# EAGLE design led-pcb (EAGLE 7.2.0)
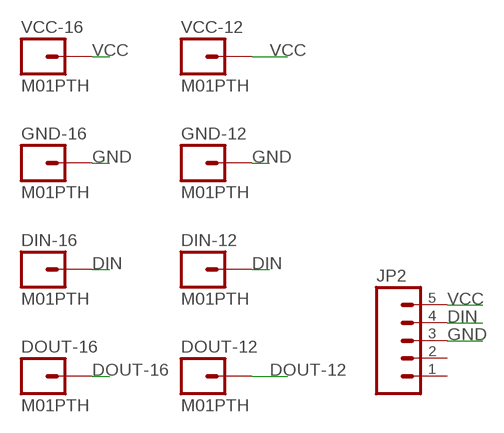
[diagram p0: schematic, sheet 1]

## Parts
DIN-12  M01PTH  [1X01]
DIN-16  M01PTH  [1X01]
DOUT-12  M01PTH  [1X01]
DOUT-16  M01PTH  [1X01]
GND-12  M01PTH  [1X01]
GND-16  M01PTH  [1X01]
JP2  M05PTH  [1X05]
VCC-12  M01PTH  [1X01]
VCC-16  M01PTH  [1X01]

## Nets
DIN: DIN-12.1 DIN-16.1 JP2.4
DOUT-12: DOUT-12.1
DOUT-16: DOUT-16.1
GND: GND-12.1 GND-16.1 JP2.3
VCC: JP2.5 VCC-12.1 VCC-16.1
Unconnected: JP2.1 JP2.2

## Library data of the parts
DIN-12 DIN-16 DOUT-12 DOUT-16 GND-12 GND-16 VCC-12 VCC-16 = USB3.0:M01: Header 1 Standard 1-pin 0.1" header. Use with straight break away headers (SKU : PRT-00116), right angle break away headers (PRT-00553), swiss pins (PRT-00743), machine pins (PRT-00117), and female headers (PRT-00115).
JP2 = USB3.0:M05: Header 5 Standard 5-pin 0.1" header. Use with straight break away headers (SKU : PRT-00116), right angle break away headers (PRT-00553), swiss pins (PRT-00743), machine pins (PRT-00117), and female headers (PRT-00115). Molex polarized connector foot print use with SKU : PRT-08230 with associated crimp pins and housings.

## Board
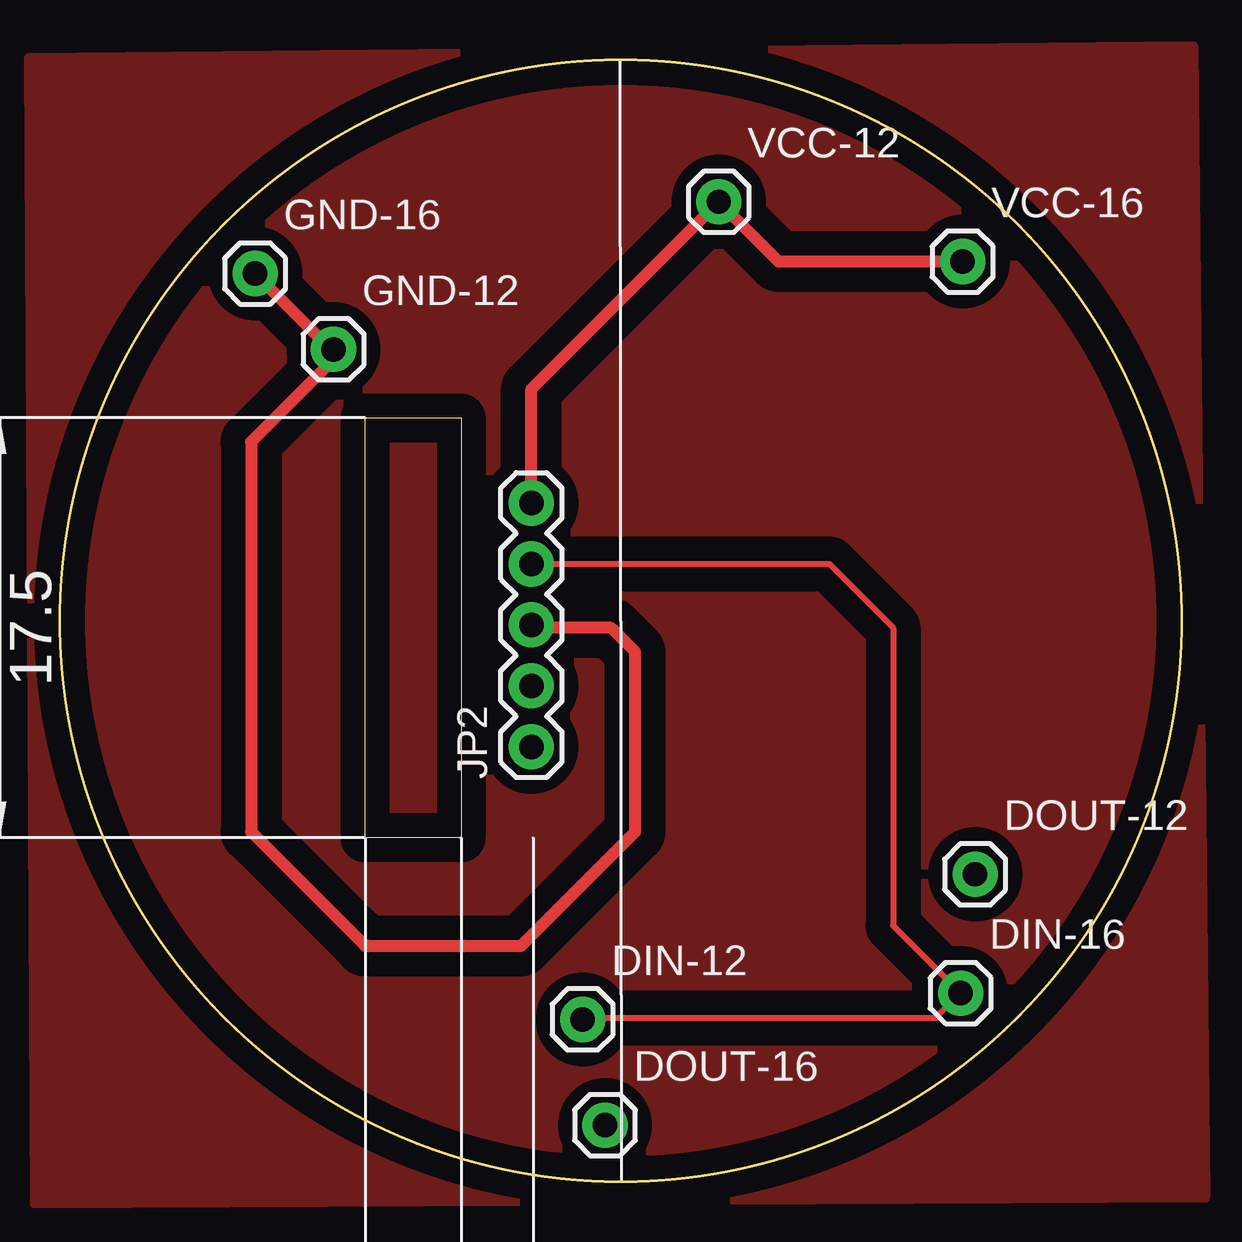
[diagram p1: board, top side]

Size 46.74 x 46.74 mm. Coordinates in mm from the lower left corner, seen from the top.
Outline: 12.72,31.83 16.72,31.83 16.72,14.33 12.72,14.33 12.72,31.83
Outline: circle at 23.37,23.37 radius 23.37
Copper layers (1*16): Top 0.035mm / dielectric 1.5mm / Bottom 0.035mm
Design rules "default": minimum track width 10mil, minimum drill 24mil, track to track 8mil, track to pad 8mil, pad to pad 8mil, via to via 8mil, smd to smd 8mil, copper to edge 40mil, drill to drill 8mil, minimum pad ring 10mil, minimum via ring 8mil, stop-mask expansion 4mil, vias tented up to drill 0mil, thermal gap 10mil

### Footprints (pad centres in the part's own frame; a part is rotated, then mirrored left to right if it is on the bottom)
1X01 = drill 1.016 pad 1.88: 1 0,0
1X05 = drill 1.016 pad 1.88: 1 0,0; 2 2.54,0; 3 5.08,0; 4 7.62,0; 5 10.16,0

### Placement (x,y rotation side)
DIN-12  21.78,6.76 0 top
DIN-16  37.53,7.86 0 top
DOUT-12  38.13,12.81 0 top
DOUT-16  22.71,2.36 0 top
GND-12  11.4,34.68 0 top
GND-16  8.13,37.84 0 top
JP2  19.64,18.12 90 top
VCC-12  27.45,40.83 0 top
VCC-16  37.61,38.34 0 top

### Tracks (layer width: path | path; a pad name or v marks a point on that pad's centre or on a via)
DIN
  Top 0.254: 21.72,6.82 DIN-12.1 21.72,6.83 36.5,6.83 DIN-16.1 34.72,10.67 34.72,23.08 32.06,25.74 JP2.4
GND
  Top 0.254: GND-12.1 11.29,34.68
  Top 0.508: 11.29,34.68 GND-16.1 | GND-12.1 11.4,34.15 11.29,34.15 7.97,30.83 7.97,14.58 12.72,9.83 19.22,9.83 23.97,14.58 23.97,22.08 22.97,23.08 19.76,23.08 JP2.3
N$1
  pour Top (isolate 1.016): -1.28,46.83 47.22,47.33 47.72,-0.67 -1.03,-0.92
VCC
  Top 0.508: VCC-16.1 29.94,38.34 VCC-12.1 | 27.72,40.56 VCC-12.1 | JP2.5 19.64,33.02 VCC-12.1